# Altium schematic sheet logic.SchDoc
size A4; SheetNumber: 4; SheetTotal: 6
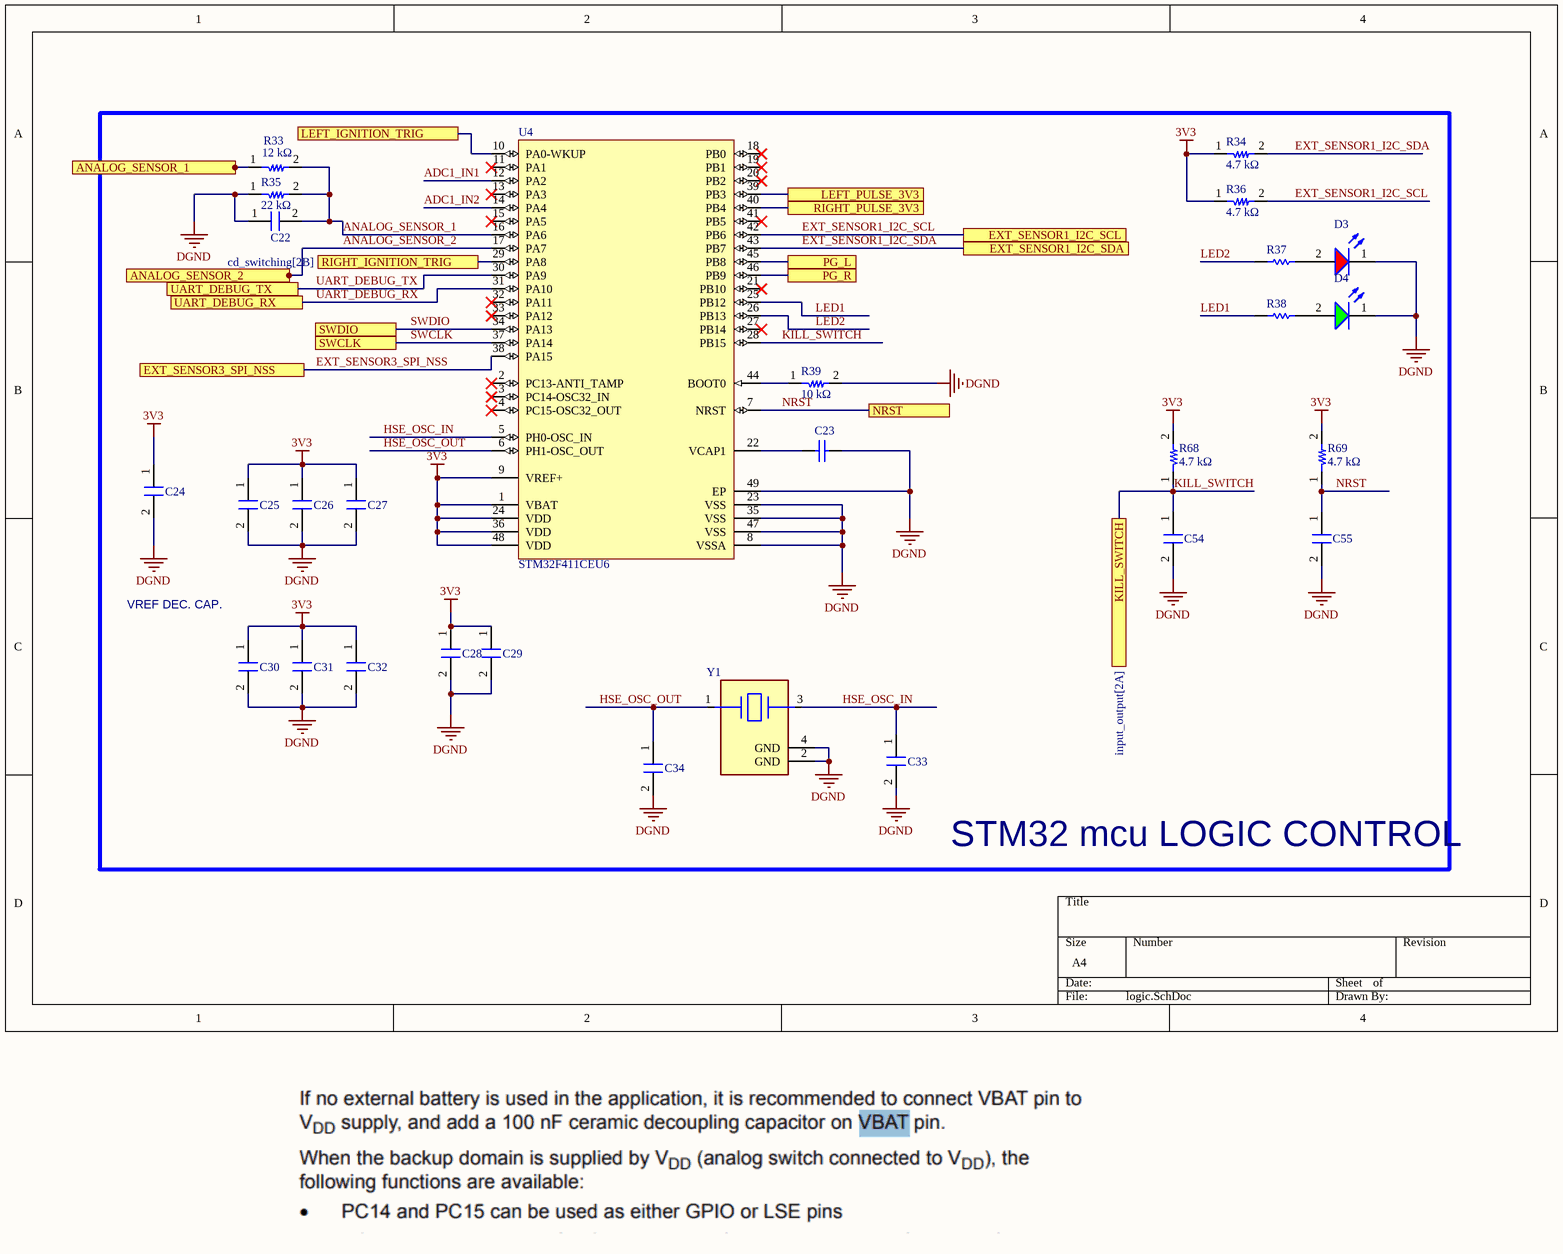
[diagram p0: logic.SchDoc]

## Parts
C22  Capacitor_0402  [0402_fp]  (value not drawn)
C23  0603ZD475MAT2A  [CAPC1608X90X35NL15T15]  (value not drawn)
C24  Capacitor_0402  [0402_fp]  (value not drawn)
C25  Capacitor_0402  [0402_fp]  (value not drawn)
C26  Capacitor_0402  [0402_fp]  (value not drawn)
C27  Capacitor_0402  [0402_fp]  (value not drawn)
C28  Capacitor_0402  [0402_fp]  (value not drawn)
C29  Capacitor_0402  [0402_fp]  (value not drawn)
C30  Capacitor_0402  [0402_fp]  (value not drawn)
C31  Capacitor_0402  [0402_fp]  (value not drawn)
C32  Capacitor_0402  [0402_fp]  (value not drawn)
C33  Capacitor_0603  [0603_FP]  (value not drawn)
C34  Capacitor_0603  [0603_FP]  (value not drawn)
C54  Capacitor_0402  [0402_fp]  (value not drawn)
C55  Capacitor_0402  [0402_fp]  (value not drawn)
D3  150080RS75000  [WL-SMCW_0805_150080xx75000]  (value not drawn)
D4  150080GS75000  [WL-SMCW_0805_150080xx75000]  (value not drawn)
R33  value 12 kΩ  [0402_fp]  (hidden comment: Resistor_0402)
R34  value 4.7 kΩ  [0402_fp]  (hidden comment: Resistor_0402)
R35  value 22 kΩ  [0402_fp]  (hidden comment: Resistor_0402)
R36  value 4.7 kΩ  [0402_fp]  (hidden comment: Resistor_0402)
R37  MCS04020D5600BE100  [RESC1005X37X20NL05T10]  (value not drawn)
R38  MCS04020D5600BE100  [RESC1005X37X20NL05T10]  (value not drawn)
R39  value 10 kΩ  [0402_fp]  (hidden comment: Resistor_0402)
R68  value 4.7 kΩ  [0402_fp]  (hidden comment: Resistor_0402)
R69  value 4.7 kΩ  [0402_fp]  (hidden comment: Resistor_0402)
U4  STM32F411CEU6  [STM-UFQFPN48_L]
Y1  NX3225GA-16.000M-STD-CRG-2  [FP-NX3225GA-MFG]  (value not drawn)

## Ports
ANALOG_SENSOR_1 (see input_output[1B]), ANALOG_SENSOR_2, EXT_SENSOR1_I2C_SCL (see input_output[1B]), EXT_SENSOR1_I2C_SDA (see input_output[1B]), EXT_SENSOR3_SPI_NSS, KILL_SWITCH (see input_output[2A]), LEFT_IGNITION_TRIG (see cd_switching[2B]), LEFT_PULSE_3V3 (see input_signal_conditioning[4B]), NRST (see input_output[3B]), PG_L (see HV_power[4B]), PG_R (see HV_power[4C]), RIGHT_IGNITION_TRIG (see cd_switching[2B]), RIGHT_PULSE_3V3 (see input_signal_conditioning[4B]), SWCLK (see input_output[3A]), SWDIO (see input_output[3A]), UART_DEBUG_RX (see input_output[2B], input_output[3C]), UART_DEBUG_TX (see input_output[2A], input_output[3B])

## Nets
3V3: C24.1 C25.1 C26.1 C27.1 C28.1 C29.1 C30.1 C31.1 C32.1 R34.1 R36.1 R68.2 R69.2 U4.1(VBAT) U4.9(VREF+) U4.24(VDD) U4.36(VDD) U4.48(VDD)
DGND: C22.1 C23.2 C24.2 C25.2 C26.2 C27.2 C28.2 C29.2 C30.2 C31.2 C32.2 C33.2 C34.2 C54.2 C55.2 D3.1(K) D4.1(K) R35.1 R39.2 U4.8(VSSA) U4.23(VSS) U4.35(VSS) U4.47(VSS) U4.49(EP) Y1.2(GND) Y1.4(GND)
ADC1_IN1: U4.12(PA2)
ADC1_IN2: U4.14(PA4)
ANALOG_SENSOR_1: C22.2 R33.2 R35.2 U4.16(PA6)
ANALOG_SENSOR_1: R33.1 ; port ANALOG_SENSOR_1  [a separate net that carries the same name]
ANALOG_SENSOR_2: U4.17(PA7) ; port ANALOG_SENSOR_2
EXT_SENSOR1_I2C_SCL: R36.2 U4.42(PB6) ; port EXT_SENSOR1_I2C_SCL
EXT_SENSOR1_I2C_SDA: R34.2 U4.43(PB7) ; port EXT_SENSOR1_I2C_SDA
EXT_SENSOR3_SPI_NSS: U4.38(PA15) ; port EXT_SENSOR3_SPI_NSS
HSE_OSC_IN: C33.1 U4.5(PH0-OSC_IN) Y1.3
HSE_OSC_OUT: C34.1 U4.6(PH1-OSC_OUT) Y1.1
KILL_SWITCH: C54.1 R68.1 U4.28(PB15) ; port KILL_SWITCH
LED1: R38.1 U4.25(PB12)
LED2: R37.1 U4.26(PB13)
LEFT_IGNITION_TRIG: U4.10(PA0-WKUP) ; port LEFT_IGNITION_TRIG
LEFT_PULSE_3V3: U4.39(PB3) ; port LEFT_PULSE_3V3
NRST: C55.1 R69.1 U4.7(NRST) ; port NRST
PG_L: U4.45(PB8) ; port PG_L
PG_R: U4.46(PB9) ; port PG_R
RIGHT_IGNITION_TRIG: U4.29(PA8) ; port RIGHT_IGNITION_TRIG
RIGHT_PULSE_3V3: U4.40(PB4) ; port RIGHT_PULSE_3V3
SWCLK: U4.37(PA14) ; port SWCLK
SWDIO: U4.34(PA13) ; port SWDIO
UART_DEBUG_RX: U4.31(PA10) ; port UART_DEBUG_RX
UART_DEBUG_TX: U4.30(PA9) ; port UART_DEBUG_TX
NetC23_1: C23.1 U4.22(VCAP1)
NetD3_2: D3.2(A) R37.2
NetD4_2: D4.2(A) R38.2
NetR39_1: R39.1 U4.44(BOOT0)

Not connected (* = marked no-connect by the designer): U4 2(PC13-ANTI_TAMP)* 3(PC14-OSC32_IN)* 4(PC15-OSC32_OUT)* 11(PA1)* 13(PA3)* 15(PA5)* 18(PB0)* 19(PB1)* 20(PB2)* 21(PB10)* 27(PB14)* 32(PA11)* 33(PA12)* 41(PB5)*

## Notes on the sheet
- VREF DEC. CAP.
- STM32 mcu LOGIC CONTROL

## Library data of the parts
C22 = Capacitor_0402: Value: 1 nF; Format: 0402; Package: 0402
C23 = CMP-1035-02787-2: Manufacturer: AVX Interconnect / Elco; Part Number: 0603ZD475MAT2A
C24 C54 C55 = Capacitor_0402: Value: 100 nF; Format: 0402; Package: 0402
C25-C32 = Capacitor_0402: Value: 10 nF; Format: 0402; Package: 0402
C33 C34 = Capacitor_0603: Value: 10 pF; Format: 0402; Package: 0402
D3 = CMP-1426-00011-3: LED Uni-Color Red 630nm 2-Pin Chip 0805(2012Metric) T/R; Viewing Angle: 140°; Max Junction Temperature (Tj): 95°C; Power Dissipation: 72mW; Forward Current: 100mA; Forward Voltage: 2V; Wavelength: 625nm; Test Current: 20mA; Max Reverse Voltage (DC): 5V; Luminous Intensity: 150mcd; Lens Style: Clear, Rectangular; REACH SVHC: Unknown; Height: 700µm; Case Code (Metric): 2012; Peak Wavelength: 630nm; Length: 2mm; Width: 1.25mm; RoHS: Compliant; Packaging: Tape and Reel; Dominant Wavelength: 625nm; Color: Red; Case Code (Imperial): 0805; Min Operating Temperature: -40°C; Mount: Surface Mount; Max Operating Temperature: 85°C; Case/Package: 0805
D4 = CMP-1426-00007-3: WURTH ELEKTRONIK - 150080GS75000 - LED, Green, SMD, 0805, 30 mA, 3.2 V, 520 nm; Forward Voltage: 3.2V; Viewing Angle: 140°; Power Dissipation: 105mW; Peak Wavelength: 515nm; Max Reverse Voltage (DC): 5V; Luminous Intensity: 450mcd; Wavelength: 525nm; Max Junction Temperature (Tj): 95°C; Forward Current: 100mA; Test Current: 20mA; Lens Style: Clear, Rectangular; Length: 2mm; Case/Package: 0805; Case Code (Metric): 2012; Color: Green; Height: 700µm; Width: 1.25mm; Packaging: Tape and Reel; Mount: Surface Mount; REACH SVHC: Unknown; RoHS: Compliant; Min Operating Temperature: -40°C; Reverse Voltage: 5V; Max Operating Temperature: 85°C; Dominant Wavelength: 525nm; Case Code (Imperial): 0805
R37 R38 = CMP-2002-02518-1: Manufacturer: Vishay BCcomponents; Part Number: MCS04020D5600BE100
U4 = CMP-0243-00165-1: ARM Cortex-M4 32-bit MCU+FPU, 512 KB Flash, 128 KB RAM, 36 I/Os, 48-Pin UFQFPN, -40 to 85 degC, Tray; Operating Frequency(F) (Processor speed) (MHz): 100; FLASH Size (Prog) (kB): 512; Internal RAM Size (kB): 128; I/Os (High Current): 36; Supply Voltage(Vcc) min (V): 1.7; Package Reference: 48-Pin Ultra Thin Fine Pitch Quad Flat No-Lead, 7 x 7 x 0.6 mm Body, 0.5 mm Pitch, Exposed Pad; ComponentLink1Description: Manufacturer URL; ComponentLink1URL: http://www.st.com/; Packing: Tray; Package Description: UFQFPN48; Core: ARM Cortex-M4; ComponentLink2Description: Datasheet; ComponentLink2URL: http://www.st.com/st-web-ui/static/active/en/resource/technical/document/datasheet/DM00115249.pdf; DatasheetVersion: Rev. 6; Mounting Technology: Surface Mount
Y1 = CMP-200220-000007-1: CRYSTAL 16.0000MHZ 8PF SMD; Frequency Stability: 30ppm; Frequency Tolerance: 20ppm; Frequency: 16MHz; ESR (Equivalent Series Resistance): 80R; Min Operating Temperature: -40°C; Mount: Surface Mount; Width: 0.098inch; Case/Package: SMD/SMT; Max Operating Temperature: 85°C; Number of Pins: 4; Length: 0.126inch; Load Capacitance: 8pF; Packaging: Tape and Reel; Package Quantity: 3000; Height: 0.035inch
R33-R36 R39 R68 R69 = Resistor_0402: Package: 0402